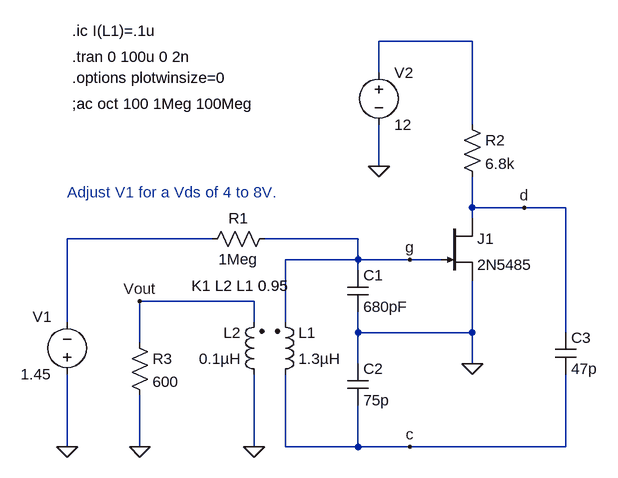
[diagram p0: schematic Colpitts_Oscillator_AoE_Horowitz_pg_298_1.asc]
Colpitts_Oscillator_AoE_Horowitz_pg_298_1.asc, the LTspice schematic file:
Version 4
SHEET 1 1508 680
WIRE 400 -320 256 -320
WIRE 256 -272 256 -320
WIRE 400 -192 400 -320
WIRE 256 -128 256 -192
WIRE 400 -64 400 -112
WIRE 480 -64 400 -64
WIRE 544 -64 480 -64
WIRE 400 -48 400 -64
WIRE 0 -16 -224 -16
WIRE 224 -16 80 -16
WIRE 224 16 224 -16
WIRE 224 16 112 16
WIRE 304 16 224 16
WIRE 352 16 304 16
WIRE 224 32 224 16
WIRE 64 80 -112 80
WIRE -224 112 -224 -16
WIRE 64 112 64 80
WIRE 112 112 112 16
WIRE 224 128 224 96
WIRE 400 128 400 48
WIRE 400 128 224 128
WIRE 544 128 544 -64
WIRE -112 144 -112 80
WIRE 224 176 224 128
WIRE 400 176 400 128
WIRE -224 304 -224 192
WIRE -112 304 -112 224
WIRE 64 304 64 192
WIRE 112 304 112 192
WIRE 224 304 224 240
WIRE 224 304 112 304
WIRE 304 304 224 304
WIRE 544 304 544 192
WIRE 544 304 304 304
FLAG 400 176 0
FLAG -224 304 0
FLAG 256 -128 0
FLAG 64 304 0
FLAG -112 80 Vout
FLAG -112 304 0
FLAG 480 -64 d
FLAG 304 16 g
FLAG 304 304 c
SYMBOL res -16 0 R270
WINDOW 0 32 56 VTop 0
WINDOW 3 0 56 VBottom 0
SYMATTR InstName R1
SYMATTR Value 1Meg
SYMBOL res 384 -208 R0
SYMATTR InstName R2
SYMATTR Value 6.8k
SYMBOL ind2 96 208 M180
WINDOW 0 36 80 Left 0
WINDOW 3 36 40 Left 0
SYMATTR InstName L1
SYMATTR Value 1.3µH
SYMATTR Type ind
SYMBOL cap 208 32 R0
SYMATTR InstName C1
SYMATTR Value 680pF
SYMBOL cap 208 176 R0
SYMATTR InstName C2
SYMATTR Value 75p
SYMBOL cap 528 128 R0
SYMATTR InstName C3
SYMATTR Value 47p
SYMBOL njf 352 -48 R0
SYMATTR InstName J1
SYMATTR Value 2N5485
SYMBOL ind2 80 208 R180
WINDOW 0 36 80 Left 0
WINDOW 3 36 40 Left 0
SYMATTR InstName L2
SYMATTR Value 0.1µH
SYMATTR Type ind
SYMBOL voltage -224 208 R180
WINDOW 0 24 104 Left 0
WINDOW 3 24 16 Left 0
WINDOW 123 0 0 Left 0
WINDOW 39 0 0 Left 0
SYMATTR InstName V1
SYMATTR Value 1.45
SYMBOL voltage 256 -288 R0
WINDOW 123 0 0 Left 0
WINDOW 39 0 0 Left 0
SYMATTR InstName V2
SYMATTR Value 12
SYMBOL res -128 128 R0
SYMATTR InstName R3
SYMATTR Value 600
TEXT -216 -296 Left 0 !.tran 0 100u 0 2n
TEXT -32 56 Left 0 !K1 L2 L1 0.95
TEXT -216 -224 Left 0 !;ac oct 100 1Meg 100Meg
TEXT -216 -336 Left 0 !.ic I(L1)=.1u
TEXT -216 -264 Left 0 !.options plotwinsize=0
TEXT -224 -88 Left 0 ;Adjust V1 for a Vds of 4 to 8V.

The netlist it stands for:
* Colpitts_Oscillator_AoE_Horowitz_pg_298_1.asc
R1 N002 g 1Meg
R2 N001 d 6.8k
L1 c g 1.3µH
C1 g 0 680pF
C2 0 c 75p
C3 d c 47p
J1 d g 0 2N5485
L2 0 Vout 0.1µH
V1 0 N002 1.45
V2 N001 0 12
R3 Vout 0 600
.model NJF NJF
.model PJF PJF
.lib standard.jft
.tran 0 100u 0 2n
K1 L2 L1 0.95
;ac oct 100 1Meg 100Meg
.ic I(L1)=.1u
.options plotwinsize=0
* Adjust V1 for a Vds of 4 to 8V.
.backanno
.end